# EAGLE design Mini BDM Pod RevA (EAGLE 6.1)
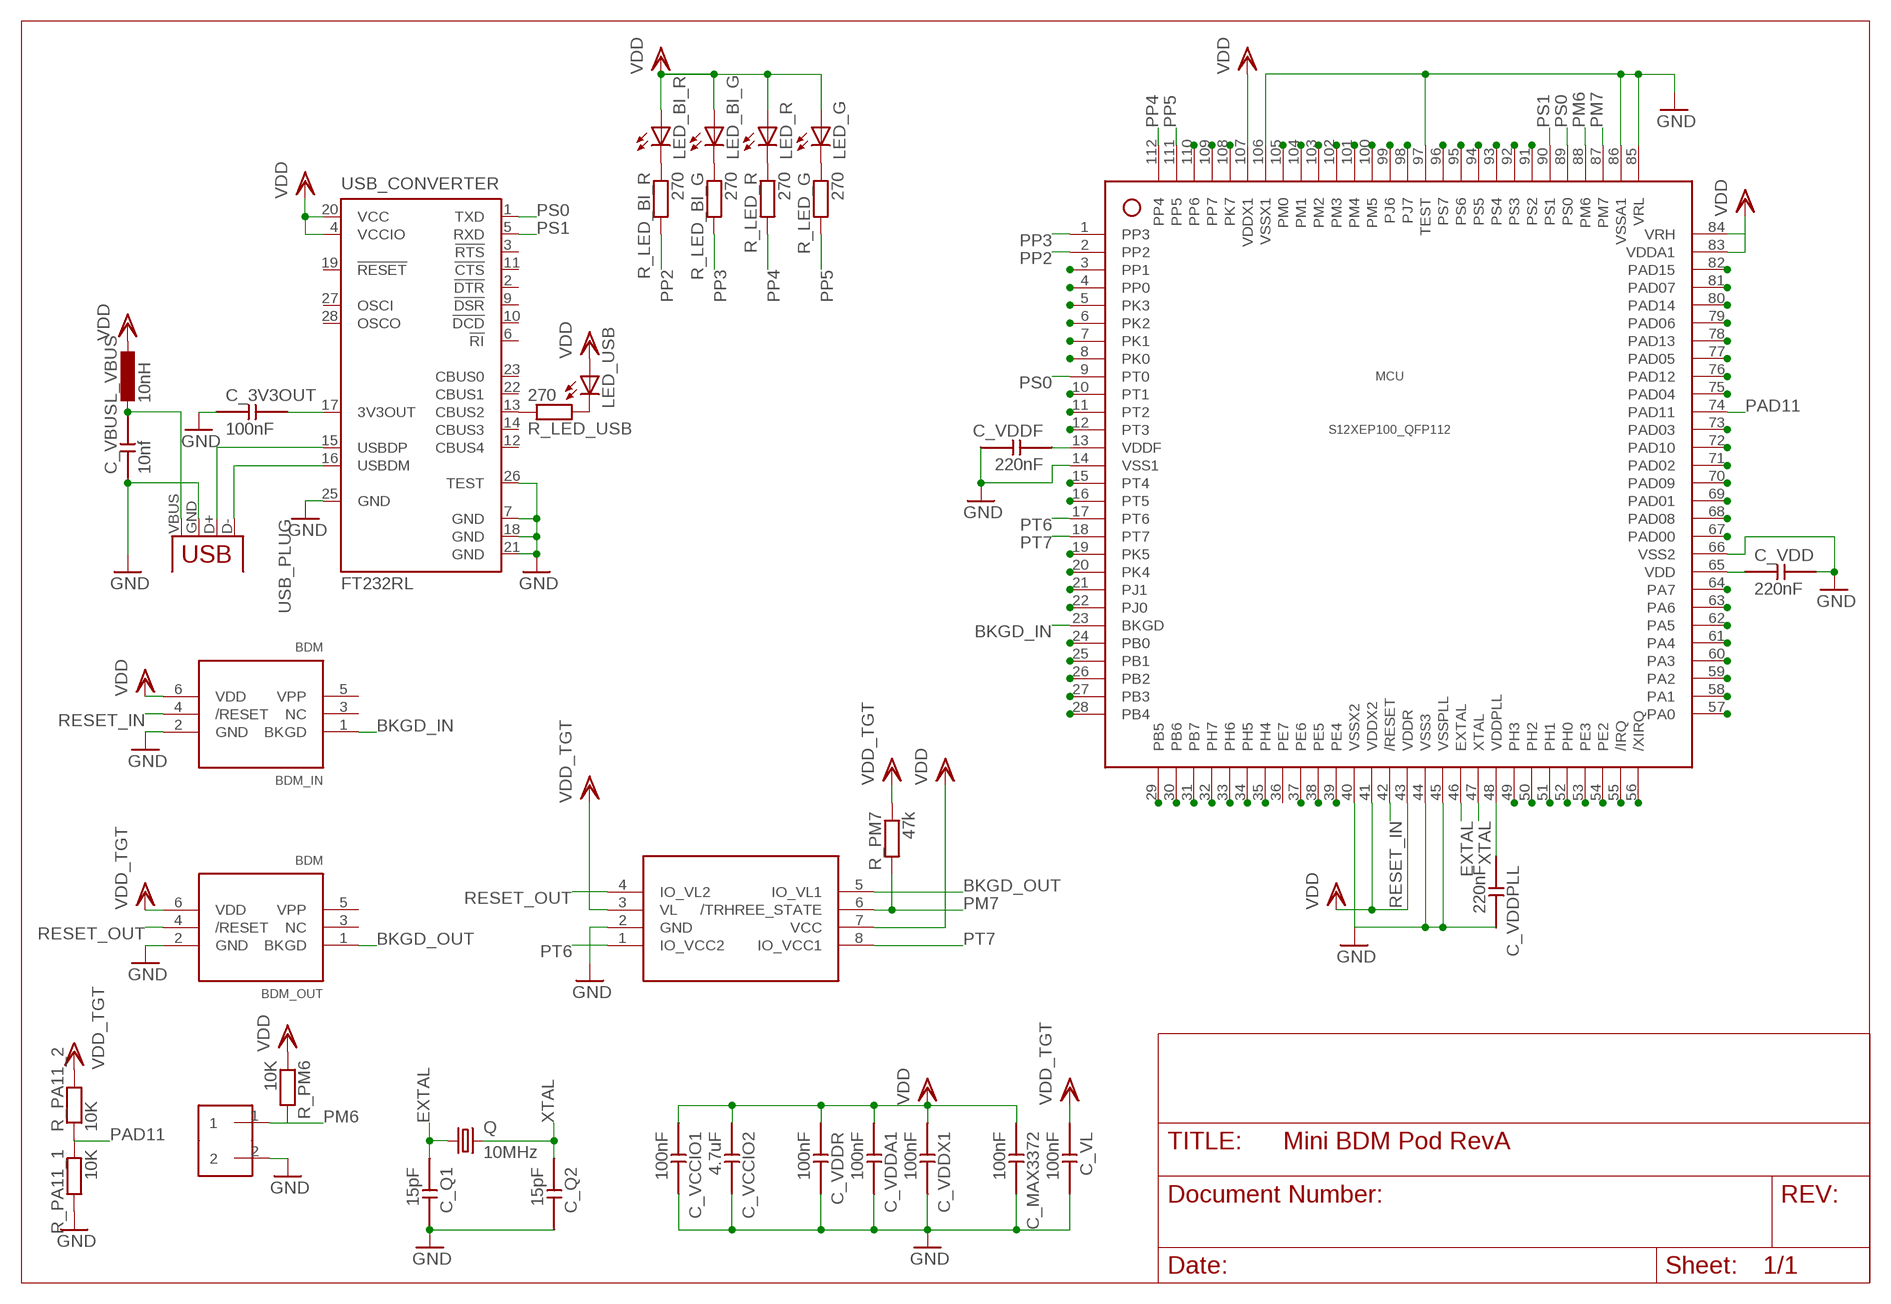
[diagram p0: schematic, sheet 1]

## Parts
BDM_IN  BDM  [BDM]
BDM_OUT  BDM  [BDM]
C_3V3OUT  100nF  C  [0805]
C_MAX3372  100nF  C  [0805]
C_Q1  15pF  C  [0805]
C_Q2  15pF  C  [0805]
C_VBUS  10nf  C  [0805]
C_VCCIO1  100nF  C  [0805]
C_VCCIO2  4.7uF  C  [0805]
C_VDD  220nF  C  [0805]
C_VDDA1  100nF  C  [0805]
C_VDDF  220nF  C  [0805]
C_VDDPLL  220nF  C  [0805]
C_VDDR  100nF  C  [0805]
C_VDDX1  100nF  C  [0805]
C_VL  100nF  C  [0805]
JUMPER  1X2  [1X2]
L_VBUS  10nH  L0805  [0805]
LED_BI_G  LED0805  [0805]
LED_BI_R  LED0805  [0805]
LED_G  LED0805  [0805]
LED_R  LED0805  [0805]
LED_USB  LED0805  [0805]
LEVEL_SHIFTER  MAX3373  [SOT-23-MAXIM]
MCU  S12XEP100_QFP112  [QFP112]
Q  10MHz  CRYSTALHC49U70  [HC49U70]
R_LED_BI_G  270  R  [0805]
R_LED_BI_R  270  R  [0805]
R_LED_G  270  R  [0805]
R_LED_R  270  R  [0805]
R_LED_USB  270  R  [0805]
R_PA11_1  10K  R  [0805]
R_PA11_2  10K  R  [0805]
R_PM6  10K  R  [0805]
R_PM7  47k  R  [0805]
USB_CONVERTER  FT232RL  [SSOP28]
USB_PLUG  USB_PRINT-A  [A]

## Nets
3V3OUT: C_3V3OUT.1 USB_CONVERTER.17(3V3OUT)
BKGD_IN: BDM_IN.1(BKGD) MCU.23(BKGD)
BKGD_OUT: BDM_OUT.1(BKGD) LEVEL_SHIFTER.5(IO_VL1)
D+: USB_CONVERTER.15(USBDP) USB_PLUG.D+(D-)
D-: USB_CONVERTER.16(USBDM) USB_PLUG.D-(D+)
EXTAL: C_Q1.2 MCU.46(EXTAL) Q.1
GND: BDM_IN.2(GND) BDM_OUT.2(GND) C_3V3OUT.2 C_MAX3372.1 C_Q1.1 C_Q2.1 C_VBUS.2 C_VCCIO1.1 C_VCCIO2.1 C_VDD.1 C_VDDA1.1 C_VDDF.1 C_VDDPLL.1 C_VDDR.1 C_VDDX1.1 C_VL.1 JUMPER.2 LEVEL_SHIFTER.2(GND) MCU.14(VSS1) MCU.40(VSSX2) MCU.44(VSS3) MCU.45(VSSPLL) MCU.66(VSS2) MCU.85(VRL) MCU.86(VSSA1) MCU.97(TEST) MCU.106(VSSX1) R_PA11_1.1 USB_CONVERTER.7(GND) USB_CONVERTER.18(GND) USB_CONVERTER.21(GND) USB_CONVERTER.25(GND) USB_CONVERTER.26(TEST) USB_PLUG.GND(VBUS)
N$2: R_LED_USB.2 USB_CONVERTER.13(CBUS2)
N$3: LED_USB.2(C) R_LED_USB.1
N$4: C_VBUS.1 L_VBUS.2 USB_PLUG.VBUS(GND)
N$6: C_VDD.2 MCU.65(VDD)
N$7: MCU.109(PP7)
N$8: MCU.110(PP6)
N$9: LED_BI_R.2(C) R_LED_BI_R.2
N$11: MCU.3(PP1)
N$12: MCU.4(PP0)
N$13: MCU.94(PS5)
N$14: MCU.95(PS6)
N$15: MCU.96(PS7)
N$16: MCU.38(PE5)
N$17: MCU.37(PE6)
N$18: MCU.91(PS2)
N$19: MCU.92(PS3)
N$20: MCU.93(PS4)
N$21: MCU.108(PK7)
N$22: MCU.5(PK3)
N$23: MCU.10(PT1)
N$24: MCU.11(PT2)
N$25: MCU.12(PT3)
N$26: MCU.15(PT4)
N$27: MCU.16(PT5)
N$28: MCU.19(PK5)
N$29: MCU.20(PK4)
N$30: MCU.21(PJ1)
N$31: MCU.22(PJ0)
N$32: MCU.39(PE4)
N$33: MCU.53(PE3)
N$34: MCU.82(PAD15)
N$35: MCU.81(PAD07)
N$36: MCU.80(PAD14)
N$37: MCU.79(PAD06)
N$38: MCU.78(PAD13)
N$39: MCU.77(PAD05)
N$40: MCU.76(PAD12)
N$41: MCU.75(PAD04)
N$42: MCU.73(PAD03)
N$43: MCU.71(PAD02)
N$44: MCU.72(PAD10)
N$45: MCU.70(PAD09)
N$46: MCU.57(PA0)
N$47: MCU.58(PA1)
N$48: MCU.59(PA2)
N$49: MCU.60(PA3)
N$50: MCU.61(PA4)
N$51: MCU.62(PA5)
N$52: MCU.63(PA6)
N$53: MCU.64(PA7)
N$54: MCU.24(PB0)
N$55: MCU.25(PB1)
N$56: MCU.26(PB2)
N$57: MCU.27(PB3)
N$58: MCU.28(PB4)
N$59: MCU.29(PB5)
N$60: MCU.30(PB6)
N$61: MCU.31(PB7)
N$62: MCU.105(PM0)
N$63: MCU.104(PM1)
N$64: MCU.103(PM2)
N$65: MCU.102(PM3)
N$66: MCU.101(PM4)
N$67: MCU.100(PM5)
N$68: MCU.7(PK1)
N$69: MCU.6(PK2)
N$70: MCU.52(PH0)
N$71: MCU.51(PH1)
N$72: MCU.50(PH2)
N$73: MCU.49(PH3)
N$74: MCU.35(PH4)
N$75: MCU.33(PH6)
N$76: MCU.32(PH7)
N$77: MCU.34(PH5)
N$78: MCU.55(/IRQ)
N$79: MCU.56(/XIRQ)
N$80: MCU.54(PE2)
N$81: MCU.8(PK0)
N$82: LED_BI_G.2(C) R_LED_BI_G.2
N$83: LED_R.2(C) R_LED_R.2
N$88: LED_G.2(C) R_LED_G.2
N$91: MCU.99(PJ6)
N$92: MCU.98(PJ7)
N$93: MCU.69(PAD01)
N$94: MCU.68(PAD08)
N$95: MCU.67(PAD00)
PAD11: MCU.74(PAD11) R_PA11_1.2 R_PA11_2.2
PM6: JUMPER.1 MCU.88(PM6) R_PM6.1
PM7: LEVEL_SHIFTER.6(/TRHREE_STATE) MCU.87(PM7) R_PM7.1
PP2: MCU.2(PP2) R_LED_BI_R.1
PP3: MCU.1(PP3) R_LED_BI_G.1
PP4: MCU.112(PP4) R_LED_R.1
PP5: MCU.111(PP5) R_LED_G.1
PS0: MCU.9(PT0) MCU.89(PS0) USB_CONVERTER.1(TXD)
PS1: MCU.90(PS1) USB_CONVERTER.5(RXD)
PT6: LEVEL_SHIFTER.1(IO_VCC2) MCU.17(PT6)
PT7: LEVEL_SHIFTER.8(IO_VCC1) MCU.18(PT7)
RESET_IN: BDM_IN.4(/RESET) MCU.42(/RESET)
RESET_OUT: BDM_OUT.4(/RESET) LEVEL_SHIFTER.4(IO_VL2)
VDD: BDM_IN.6(VDD) C_MAX3372.2 C_VCCIO1.2 C_VCCIO2.2 C_VDDA1.2 C_VDDR.2 C_VDDX1.2 L_VBUS.1 LED_BI_G.1(A) LED_BI_R.1(A) LED_G.1(A) LED_R.1(A) LED_USB.1(A) LEVEL_SHIFTER.7(VCC) MCU.41(VDDX2) MCU.43(VDDR) MCU.83(VDDA1) MCU.84(VRH) MCU.107(VDDX1) R_PM6.2 USB_CONVERTER.4(VCCIO) USB_CONVERTER.20(VCC)
VDD_TGT: BDM_OUT.6(VDD) C_VL.2 LEVEL_SHIFTER.3(VL) R_PA11_2.1 R_PM7.2
VDDF: C_VDDF.2 MCU.13(VDDF)
VDDPLL: C_VDDPLL.2 MCU.48(VDDPLL)
XTAL: C_Q2.2 MCU.47(XTAL) Q.2
Unconnected: BDM_IN.3(NC) BDM_IN.5(VPP) BDM_OUT.3(NC) BDM_OUT.5(VPP) MCU.36(PE7) USB_CONVERTER.2(!DTR) USB_CONVERTER.3(!RTS) USB_CONVERTER.6(!RI) USB_CONVERTER.9(!DSR) USB_CONVERTER.10(!DCD) USB_CONVERTER.11(!CTS) USB_CONVERTER.12(CBUS4) USB_CONVERTER.14(CBUS3) USB_CONVERTER.19(!RESET) USB_CONVERTER.22(CBUS1) USB_CONVERTER.23(CBUS0) USB_CONVERTER.27(OSCI) USB_CONVERTER.28(OSCO)

## Library data of the parts
BDM_IN BDM_OUT = myLibrary:BDM
C_3V3OUT C_MAX3372 C_Q1 C_Q2 C_VBUS C_VCCIO1 C_VCCIO2 C_VDD C_VDDA1 C_VDDF C_VDDPLL C_VDDR C_VDDX1 C_VL = myLibrary:C
JUMPER = myLibrary:1X2
L_VBUS = myLibrary:L
LED_BI_G LED_BI_R LED_G LED_R LED_USB = myLibrary:LED
LEVEL_SHIFTER = myLibrary:MAX3373
MCU = myLibrary:S12XEP100_QFP112
Q = crystal:CRYSTAL: CRYSTAL; OC_FARNELL: unknown; OC_NEWARK: unknown
R_LED_BI_G R_LED_BI_R R_LED_G R_LED_R R_LED_USB R_PA11_1 R_PA11_2 R_PM6 R_PM7 = myLibrary:R
USB_CONVERTER = ftdichip:FT232R: Source: http://www.ftdichip.com/Documents/DataSheets/DS_FT232R_v104.pdf; MPN: FT232RL; OC_FARNELL: 1146032; OC_NEWARK: 91K9918
USB_PLUG = myLibrary:USB_PRINT: USB Connectors USB-B-PTH is fully proven SKU : PRT-00139 USB-miniB is fully proven SKU : PRT-00587 USB-A-PCB is untested. USB-A-H is throughly reviewed, but untested. Spark Fun Electronics SKU : PRT-00437 USB-B-SMT is throughly reviewed, but untested. Needs silkscreen touching up. USB-A-S has not been used/tested USB-MB-H has not been used/tested

## Board
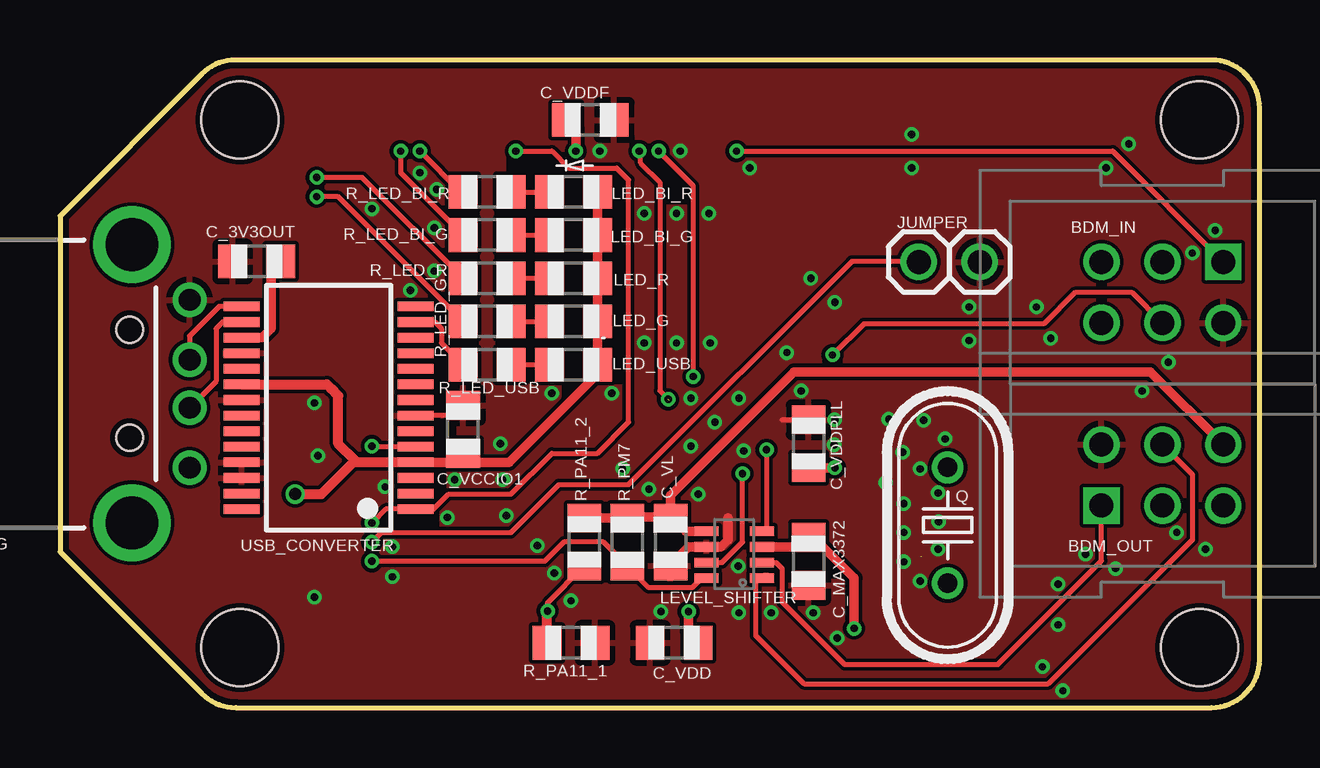
[diagram p1: board, top side]
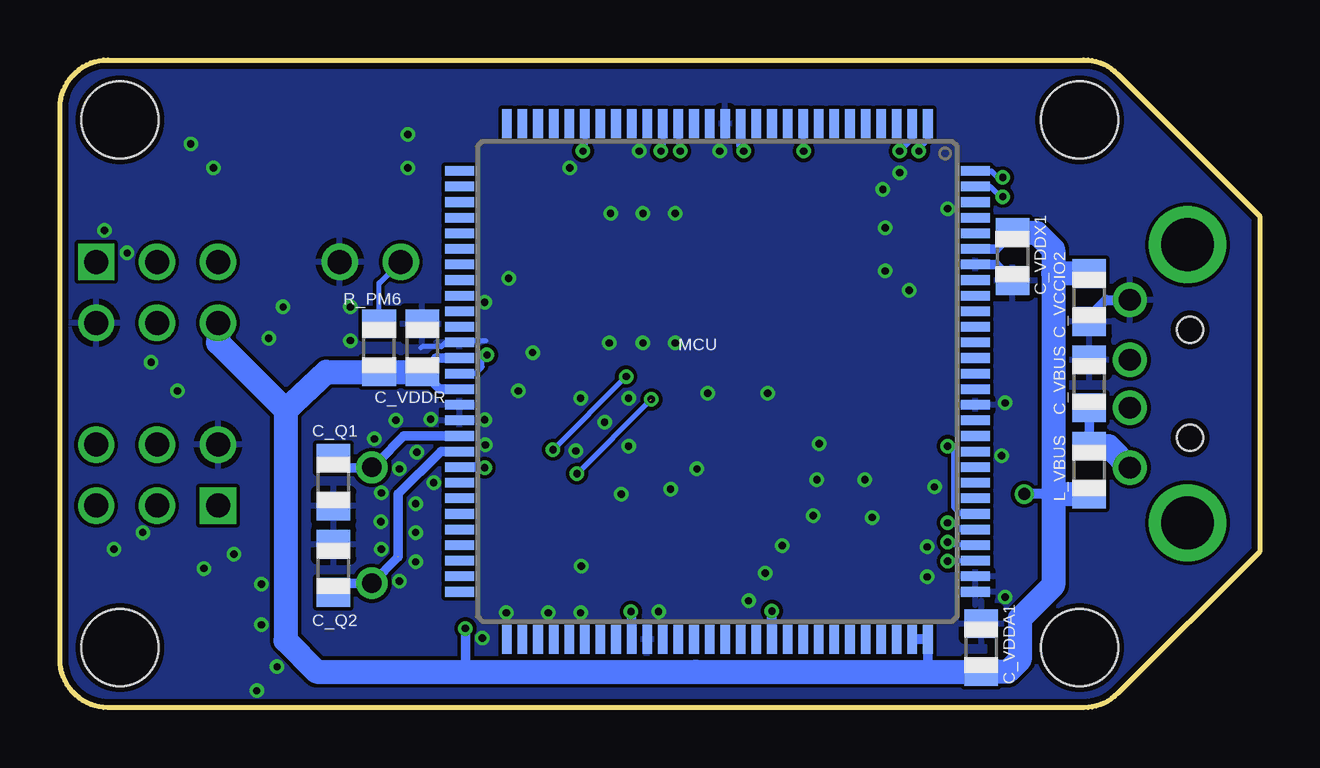
[diagram p2: board, bottom side, seen from below]

Size 50 x 27 mm. Coordinates in mm from the lower left corner, seen from the top.
Outline: 0,6.5 5.91,0.59 arc45 7.33,0 48,0 arc90 50,2 50,25 arc90 48,27 7.33,27 arc45 5.91,26.41 0,20.5 0,6.5
Copper layers (1*16): Top 0.035mm / dielectric 1.5mm / Bottom 0.035mm
Design rules: minimum track width 6mil, minimum drill 0.3mm, track to track 6mil, track to pad 6mil, pad to pad 6mil, via to via 6mil, smd to smd 0mil, copper to edge 10mil, drill to drill 10mil, minimum pad ring 10mil, minimum via ring 6mil, stop-mask expansion 2mil, vias tented up to drill 100mil, thermal gap 10mil
Holes 3.2 mm at 7.5,2.5 47.5,24.5 47.5,2.5 7.5,24.5
tRestrict: area 21.2,6.3 to 26.1,7.5; area 30.5,5.5 to 31.9,6.7; area 14.4,10.6 to 15.8,12.4; 15 lines
bRestrict: area 6.3,16.7 to 8,17.4; 3 lines

### Footprints (pad centres in the part's own frame; a part is rotated, then mirrored left to right if it is on the bottom)
BDM = drill 1 square: 1 -1.27,2.54 | drill 1: 2 1.27,2.54; 3 -1.27,0; 4 1.27,0; 5 -1.27,-2.54; 6 1.27,-2.54
0805 = smd 1.2 x 1.4: 1 -1,0; 2 1,0
1X2 = drill 1: 1 -1.27,0; 2 1.27,0
SOT-23-MAXIM = smd 0.4 x 1: 1 -0.35,1.1; 2 0.3,1.1; 3 0.95,1.1; 4 -1,-1.2; 5 -0.35,-1.2; 6 -1,1.1; 7 0.3,-1.2; 8 0.95,-1.2
QFP112 = smd 1.2 x 0.4: 1 -10.75,8.775; 2 -10.75,8.125; 3 -10.75,7.475; 4 -10.75,6.825; 5 -10.75,6.175; 6 -10.75,5.525; 7 -10.75,4.875; 8 -10.75,4.225; 9 -10.75,3.575; 10 -10.75,2.925; 11 -10.75,2.275; 12 -10.75,1.625; 13 -10.75,0.975; 14 -10.75,0.325; 15 -10.75,-0.325; 16 -10.75,-0.975; 17 -10.75,-1.625; 18 -10.75,-2.275; 19 -10.75,-2.925; 20 -10.75,-3.575; 21 -10.75,-4.225; 22 -10.75,-4.875; 23 -10.75,-5.525; 24 -10.75,-6.175; 25 -10.75,-6.825; 26 -10.75,-7.475; 27 -10.75,-8.125; 28 -10.75,-8.775; 57 10.75,-8.775; 58 10.75,-8.125; 59 10.75,-7.475; 60 10.75,-6.825; 61 10.75,-6.175; 62 10.75,-5.525; 63 10.75,-4.875; 64 10.75,-4.225; 65 10.75,-3.575; 66 10.75,-2.925; 67 10.75,-2.275; 68 10.75,-1.625; 69 10.75,-0.975; 70 10.75,-0.325; 71 10.75,0.325; 72 10.75,0.975; 73 10.75,1.625; 74 10.75,2.275; 75 10.75,2.925; 76 10.75,3.575; 77 10.75,4.225; 78 10.75,4.875; 79 10.75,5.525; 80 10.75,6.175; 81 10.75,6.825; 82 10.75,7.475; 83 10.75,8.125; 84 10.75,8.775 | smd 0.4 x 1.2: 29 -8.775,-10.75; 30 -8.125,-10.75; 31 -7.475,-10.75; 32 -6.825,-10.75; 33 -6.175,-10.75; 34 -5.525,-10.75; 35 -4.875,-10.75; 36 -4.225,-10.75; 37 -3.575,-10.75; 38 -2.925,-10.75; 39 -2.275,-10.75; 40 -1.625,-10.75; 41 -0.975,-10.75; 42 -0.325,-10.75; 43 0.325,-10.75; 44 0.975,-10.75; 45 1.625,-10.75; 46 2.275,-10.75; 47 2.925,-10.75; 48 3.575,-10.75; 49 4.225,-10.75; 50 4.875,-10.75; 51 5.525,-10.75; 52 6.175,-10.75; 53 6.825,-10.75; 54 7.475,-10.75; 55 8.125,-10.75; 56 8.775,-10.75; 85 8.775,10.75; 86 8.125,10.75; 87 7.475,10.75; 88 6.825,10.75; 89 6.175,10.75; 90 5.525,10.75; 91 4.875,10.75; 92 4.225,10.75; 93 3.575,10.75; 94 2.925,10.75; 95 2.275,10.75; 96 1.625,10.75; 97 0.975,10.75; 98 0.325,10.75; 99 -0.325,10.75; 100 -0.975,10.75; 101 -1.625,10.75; 102 -2.275,10.75; 103 -2.925,10.75; 104 -3.575,10.75; 105 -4.225,10.75; 106 -4.875,10.75; 107 -5.525,10.75; 108 -6.175,10.75; 109 -6.825,10.75; 110 -7.475,10.75; 111 -8.125,10.75; 112 -8.775,10.75
HC49U70 = drill 0.813: 1 -2.413,0; 2 2.413,0
SSOP28 = smd 0.4 x 1.5: 1 -4.225,-3.625; 2 -3.575,-3.625; 3 -2.925,-3.625; 4 -2.275,-3.625; 5 -1.625,-3.625; 6 -0.975,-3.625; 7 -0.325,-3.625; 8 0.325,-3.625; 9 0.975,-3.625; 10 1.625,-3.625; 11 2.275,-3.625; 12 2.925,-3.625; 13 3.575,-3.625; 14 4.225,-3.625; 15 4.225,3.625; 16 3.575,3.625; 17 2.925,3.625; 18 2.275,3.625; 19 1.625,3.625; 20 0.975,3.625; 21 0.325,3.625; 22 -0.325,3.625; 23 -0.975,3.625; 24 -1.625,3.625; 25 -2.275,3.625; 26 -2.925,3.625; 27 -3.575,3.625; 28 -4.225,3.625
A = drill 0.914: D+ 2.4,1; D- 2.4,-1; GND 2.4,3.5; VBUS 2.4,-3.5 | drill 2.2: GND@1 0,5.8; GND@2 0,-5.8 | hole 1.1: -0.1,2.25; -0.1,-2.25

### Placement (x,y rotation side)
BDM_IN  45.95,17.31 270 top
BDM_OUT  45.95,9.69 90 top
C_3V3OUT  8.2,18.6 180 top
C_MAX3372  31.2,6.1 90 top
C_Q1  38.6,9.4 90 bottom
C_Q2  38.6,5.8 270 bottom
C_VBUS  7.1,13.5 90 bottom
C_VCCIO1  16.8,11.6 270 top
C_VCCIO2  7.1,17.1 90 bottom
C_VDD  25.6,2.7 0 top
C_VDDA1  11.6,2.5 270 bottom
C_VDDF  22.1,24.5 180 top
C_VDDPLL  31.2,11 270 top
C_VDDR  34.9,15 270 bottom
C_VDDX1  10.3,18.8 90 bottom
C_VL  25.45,6.9 90 top
JUMPER  37.06,18.58 0 top
L_VBUS  7.1,9.9 90 bottom
LED_BI_G  21.4,19.7 180 top
LED_BI_R  21.4,21.5 180 top
LED_G  21.4,16.1 180 top
LED_R  21.4,17.9 180 top
LED_USB  21.4,14.3 180 top
LEVEL_SHIFTER  28.05,6.4 90 top
MCU  22.6,13.6 270 bottom
Q  37,7.6 270 top
R_LED_BI_G  17.8,19.7 0 top
R_LED_BI_R  17.8,21.5 0 top
R_LED_G  17.8,16.1 0 top
R_LED_R  17.8,17.9 0 top
R_LED_USB  17.8,14.3 180 top
R_PA11_1  21.3,2.7 180 top
R_PA11_2  21.85,6.9 270 top
R_PM6  36.7,15 270 bottom
R_PM7  23.65,6.9 90 top
USB_CONVERTER  11.2,12.5 90 top
USB_PLUG  3,13.5 0 top

### Tracks (layer width: path | path; a pad name or v marks a point on that pad's centre or on a via)
3V3OUT
  Top 0.4: USB_CONVERTER.17 8.43,15.43 8.8,15.8 8.8,18.6 C_3V3OUT.1
BKGD_IN  (via drill 0.3)
  Top 0.2: v28.2,23.2 43.88,23.2 BDM_IN.1
  Bottom 0.2: MCU.23 28.12,23.27 v28.2,23.2
BKGD_OUT
  Top 0.2: LEVEL_SHIFTER.5 29.85,6.05 30.1,5.8 30.1,4.4 32.7,1.8 39.1,1.8 43.41,6.11 BDM_OUT.1
D+
  Top 0.2: USB_CONVERTER.15 6.62,16.73 5.4,15.5 USB_PLUG.D+
D-
  Top 0.2: USB_CONVERTER.16 6.78,16.07 6.5,15.8 6.5,13.6 USB_PLUG.D-
EXTAL
  Bottom 0.254: 36.75,10.25 Q.1 | Q.1 36.99,10.01
  Bottom 0.4: MCU.46 35.67,11.32 36.75,10.25 36.99,10.01 | Q.1 38.2,10 C_Q1.2
GND  (via drill 0.3)
  Top 0.2: C_VDDPLL.1 30.1,12 | C_VCCIO1.1 16.65,12.6 16.32,12.18 15.03,12.18
  Top 0.4: 27.85,7.9 27.85,7 27.55,6.7 LEVEL_SHIFTER.2 26.2,6.7 25.5,6
  Top 0.406: 25.5,6 25.5,5.95 C_VL.1
  Bottom 0.2: MCU.40 33.35,15.3 | 33.35,15.3 32.25,15.3 | 33.35,15.3 33.45,15.3 33.45,15.2 33.95,15.2 34.1,15.05 34.9,15.05 34.95,15
  Bottom 0.4: MCU.106 10.97,18.48 10.5,18
  Bottom 0.406: C_VCCIO2.1 7.1,16.3 6.4,17 USB_PLUG.GND
  other vias: 25.05,4 22.5,23.2 32.3,12 29.65,3.95 31.4,3.95 36.62,7.75 27.3,11.9 26.3,10.9 28.3,12.9 18.45,9.5 24.35,20.6 25.7,20.6 27.05,20.6 18.6,8 28.5,10.7 26.3,12.9 24.55,9.1 26.6,8.9 23.45,9.95 23,13.1 30.9,13.2 30.3,14.8 20.5,13.1 18.35,11 32.3,16.9 31.3,17.9 48.15,19.9 47.2,18.95 43.6,22.5 44.55,23.5 35.5,23.9 35.5,22.5 28.75,22.5 28.3,3.95 40.95,1.7 41.8,0.7 46.55,7.3 47.75,6.6 42.75,6.4 44,5.8 40.7,16.7 41.3,15.4 37.9,15.3 37.9,16.7 19.9,6.75 20.6,5.6 13.85,6.7 13.85,5.45 45.1,13.2 46.2,14.4 27.1,15.2 25.7,15.2 24.35,15.2 10.6,12.7 10.75,10.5 13,20.8 14.6,17.4 15.6,18.2 15.6,20 21.3,4.45 32.4,2.9 41.6,5.15 41.6,3.45 25.85,23.2 15.7,21.6 15,22.3 28.27,5.9 16.45,9.5 16.15,7.93 10.6,4.6 35.12,10.65 34.42,9.38 34.55,12.02 35.85,9.95 36.6,6.6 35.17,6.07 35.17,8.5 36.6,8.95 36,11.98 36.9,11.2 35.17,7.3 35.85,5.27 32.27,10.95 13.55,9.2
  pour Bottom: 0,6.5 5.91,0.59 arc45 7.33,0 26.5,0 48,0 arc90 50,2 50,13 50,25 arc90 48,27 34,27 7.33,27 arc45 5.91,26.41 0,20.5
  pour Top (isolate 0.1): 0,6.5 5.91,0.59 arc45 7.33,0 36,0 48,0 arc90 50,2 50,16.5 50,25 arc90 48,27 34.5,27 7.33,27 arc45 5.91,26.41 0,20.5
N$2
  Top 0.2: USB_CONVERTER.13 15.62,16.07 15.9,15.8 15.9,15.2 R_LED_USB.2
N$3
  Top 0.2: R_LED_USB.1 LED_USB.2
N$4
  Bottom 0.4: C_VBUS.1 L_VBUS.2
  Bottom 1: L_VBUS.2 6.3,10.9 USB_PLUG.VBUS
N$6  (via drill 0.3)
  Top 0.4: C_VDD.2 26.2,3.1 v26.2,4
  Bottom 0.4: MCU.65 26.18,3.97 v26.2,4
N$9
  Top 0.2: R_LED_BI_R.2 LED_BI_R.2
N$82
  Top 0.2: R_LED_BI_G.2 LED_BI_G.2
N$83
  Top 0.2: R_LED_R.2 LED_R.2
N$88
  Top 0.2: R_LED_G.2 LED_G.2
PAD11  (via drill 0.3)
  Top 0.2: v20.32,4.03 20.32,4.38 R_PA11_2.2
  Top 0.406: R_PA11_1.2 20.3,4 v20.32,4.03
  Bottom 0.406: MCU.74 v20.32,4.03
PM6  (via drill 0.3)
  Top 0.2: v13,6.9 13.4,7.3 18.8,7.3 20.8,9.3 23.7,9.3 33,18.6 35.77,18.6 JUMPER.1
  Bottom 0.2: R_PM6.1 36.7,17.7 36.67,17.7 JUMPER.1 | MCU.88 12.88,6.77 v13,6.9
PM7  (via drill 0.3)
  Top 0.2: LEVEL_SHIFTER.6 26.75,5.4 26.35,5 24.55,5 R_PM7.1 22.65,6.9 21,6.9 20.2,6.1 v13,6.1
  Top 0.4: R_PM7.1 23.65,6
  Bottom 0.2: MCU.87 12.97,6.12 v13,6.1
PP2  (via drill 0.3)
  Top 0.2: v15,23.2 16.7,21.5 R_LED_BI_R.1
  Bottom 0.2: MCU.2 14.47,23.73 v15,23.2
PP3  (via drill 0.3)
  Top 0.2: v14.2,23.2 14.2,22.3 R_LED_BI_G.1
  Bottom 0.2: MCU.1 13.82,23.67 14.2,23.3 v14.2,23.2
PP4  (via drill 0.3)
  Top 0.2: R_LED_R.1 12.6,22.1 v10.7,22.1
  Bottom 0.2: MCU.112 11.18,22.38 10.9,22.1 v10.7,22.1
PP5  (via drill 0.3)
  Top 0.2: R_LED_G.1 11.6,21.3 v10.7,21.3
  Bottom 0.2: MCU.111 11.22,21.73 10.8,21.3 v10.7,21.3
PS0  (via drill 0.3)
  Top 0.2: v19,23.2 20.5,23.2 21.2,22.5 23.2,22.5 23.7,22 23.7,11.9 22.4,10.6 20.5,10.6 18.8,8.9 16.2,8.9 15.57,8.27 USB_CONVERTER.1 13.57,8.27 v13,7.7
  Bottom 0.2: MCU.9 19.02,23.23 v19,23.2 | v13,7.7 12.75,7.7 12.47,7.43 MCU.89
PS1  (via drill 0.3)
  Top 0.2: USB_CONVERTER.5 13.03,10.88 v13,10.9
  Bottom 0.2: MCU.90 12.47,8.07 12.75,8.35 12.75,10.65 v13,10.9
PT6  (via drill 0.3)  (1 unrouted)
  Top 0.2: LEVEL_SHIFTER.1 27.6,6.05 28.45,6.9 v28.45,9.75 | v24.15,23.2 24.2,23.15 24.2,22.7 25,21.9 25,13.2 v25.35,12.85
  Bottom 0.2: MCU.17 24.23,23.27 v24.15,23.2 | v28.45,9.75 25.4,12.8
PT7  (via drill 0.3)
  Top 0.2: 28.85,7.35 LEVEL_SHIFTER.8 29.45,7.35 v29.45,10.75 | v26.4,13.8 26.4,21.75 v24.95,23.2
  Bottom 0.2: MCU.18 24.88,23.27 v24.95,23.2 | v29.45,10.75 v26.4,13.8
RESET_IN  (via drill 0.3)
  Top 0.2: BDM_IN.4 44.7,17.3 42.3,17.3 41,16 33.5,16 v32.2,14.7
  Bottom 0.2: MCU.42 32.67,13.93 32.4,14.2 32.4,14.5 v32.2,14.7
RESET_OUT
  Top 0.2: BDM_OUT.4 47.2,9.71 47.2,7 41.2,1 31,1 29,3 29,5.4 29.1,5.5 29.5,5.5
  Top 0.254: 29.5,5.4 LEVEL_SHIFTER.4 29.35,5.5 29.5,5.5
VDD  (via drill 0.3, 0.5)
  Top 0.2: 18.73,10.23 16.8,10.23 C_VCCIO1.2
  Top 0.254: 31.3,7.2 C_MAX3372.2
  Top 0.4: USB_CONVERTER.4 18.73,10.23 22.4,13.9 LED_USB.1 LED_G.1 LED_R.1 LED_BI_G.1 LED_BI_R.1 | v33.1,3.3 33.1,5.4 31.3,7.2 31.3,6.7 LEVEL_SHIFTER.7
  Top 0.406: USB_CONVERTER.4 12.38,10.23 12.3,10.3 | 12.3,10.3 11.6,11 11.6,13 11.3,13.3 11.12,13.48 USB_CONVERTER.20 | v9.8,8.9 10.9,8.9 12.3,10.3
  Bottom 0.2: 23.57,1.57 23.5,1.5
  Bottom 0.4: MCU.107 10.97,19.12 C_VDDX1.2 | MCU.84 13.82,1.5 C_VDDA1.2 | MCU.43 34.17,13.27 C_VDDR.2 34.33,14.57 MCU.41 | v33.1,3.3 33.1,1.5
  Bottom 0.406: MCU.84 MCU.83 | C_VDDA1.2 11.5,1.5 | C_VDDR.2 R_PM6.2 | 8.6,8.9 v9.8,8.9
  Bottom 1: C_VCCIO2.2 8.6,18.1 | 8.6,18.1 8.6,8.9 | 8.6,8.9 L_VBUS.1 | C_VDDX1.2 9.3,19.8 8.6,19.1 8.6,18.1 | 8.6,8.9 8.6,5.1 10,3.7 10,2 10.5,1.5 11.5,1.5 | 40.6,12.4 40.6,2.8 39.3,1.5 33.1,1.5 23.5,1.5 C_VDDA1.2 | 40.6,12.4 38.9,14 R_PM6.2 C_VDDR.2 | BDM_IN.6 43.41,15.21 40.6,12.4
VDD_TGT
  Top 0.4: R_PA11_2.1 R_PM7.2 23.65,7.95 25.45,7.95 C_VL.2 25.6,7.9 25.95,8.25 | LEVEL_SHIFTER.3 26.1,7.35 25.45,8 | BDM_OUT.6 45.45,14 30.6,14 25.45,8.85 25.45,8.05 25.5,8
  Top 0.406: 25.45,8.05 25.45,8 | 25.45,8 C_VL.2 25.45,8
VDDF  (via drill 0.3)
  Top 0.4: C_VDDF.2 21.5,24.2 v21.5,23.2
  Bottom 0.4: MCU.13 21.62,23.42 v21.5,23.2
VDDPLL  (via drill 0.3)
  Top 0.4: C_VDDPLL.2 v32.3,10
  Bottom 0.4: MCU.48 32.33,10.02 v32.3,10
XTAL  (1 unrouted)
  Bottom 0.254: 38.5,5 38.5,4.9 C_Q2.2
  Bottom 0.4: 35.9,6.29 Q.2 38.31,5.19 38.5,5 | MCU.47 34.12,10.68 35.9,8.9 35.9,6.3

### Text on the board
tSilk: Mini BDM Pod | Rev. A | BDM | IN | No target | BOOT | LOADER | Target ok | Error | Busy | RX/TX | BDM | OUT | https://github.com/hotwolf/Mini-BDM-Pod
_bsilk: Dirk Heisswolf | MC9S12XEP100xAL | Order No. | XXXXX